# Altium schematic sheet 1_Main.schdoc
size 429 x 307 mm; Symbol: Drawing-Symbol_A3; Device: Drawing-Symbol_A3; @Project Name: f1c200-lom-1g; @Page Count: 1; @Update Date: 2025-12-02; @Create Date: 2025-12-02; @Schematic Name: f1c200-lom_1; @Page No: 1; @Page Name: F1C100; Company: EasyEDA.com; Version: V1.0; Page Size: A3; @Create Time: 20:13:40; @Update Time: 20:01:16; Width: 1655; Height: 1170; Region Start: 1; X Region Count: 6; Y Region Count: 4; Blade Width: 10; Title Block Position: 3; @Board Name: f1c200-dev-board
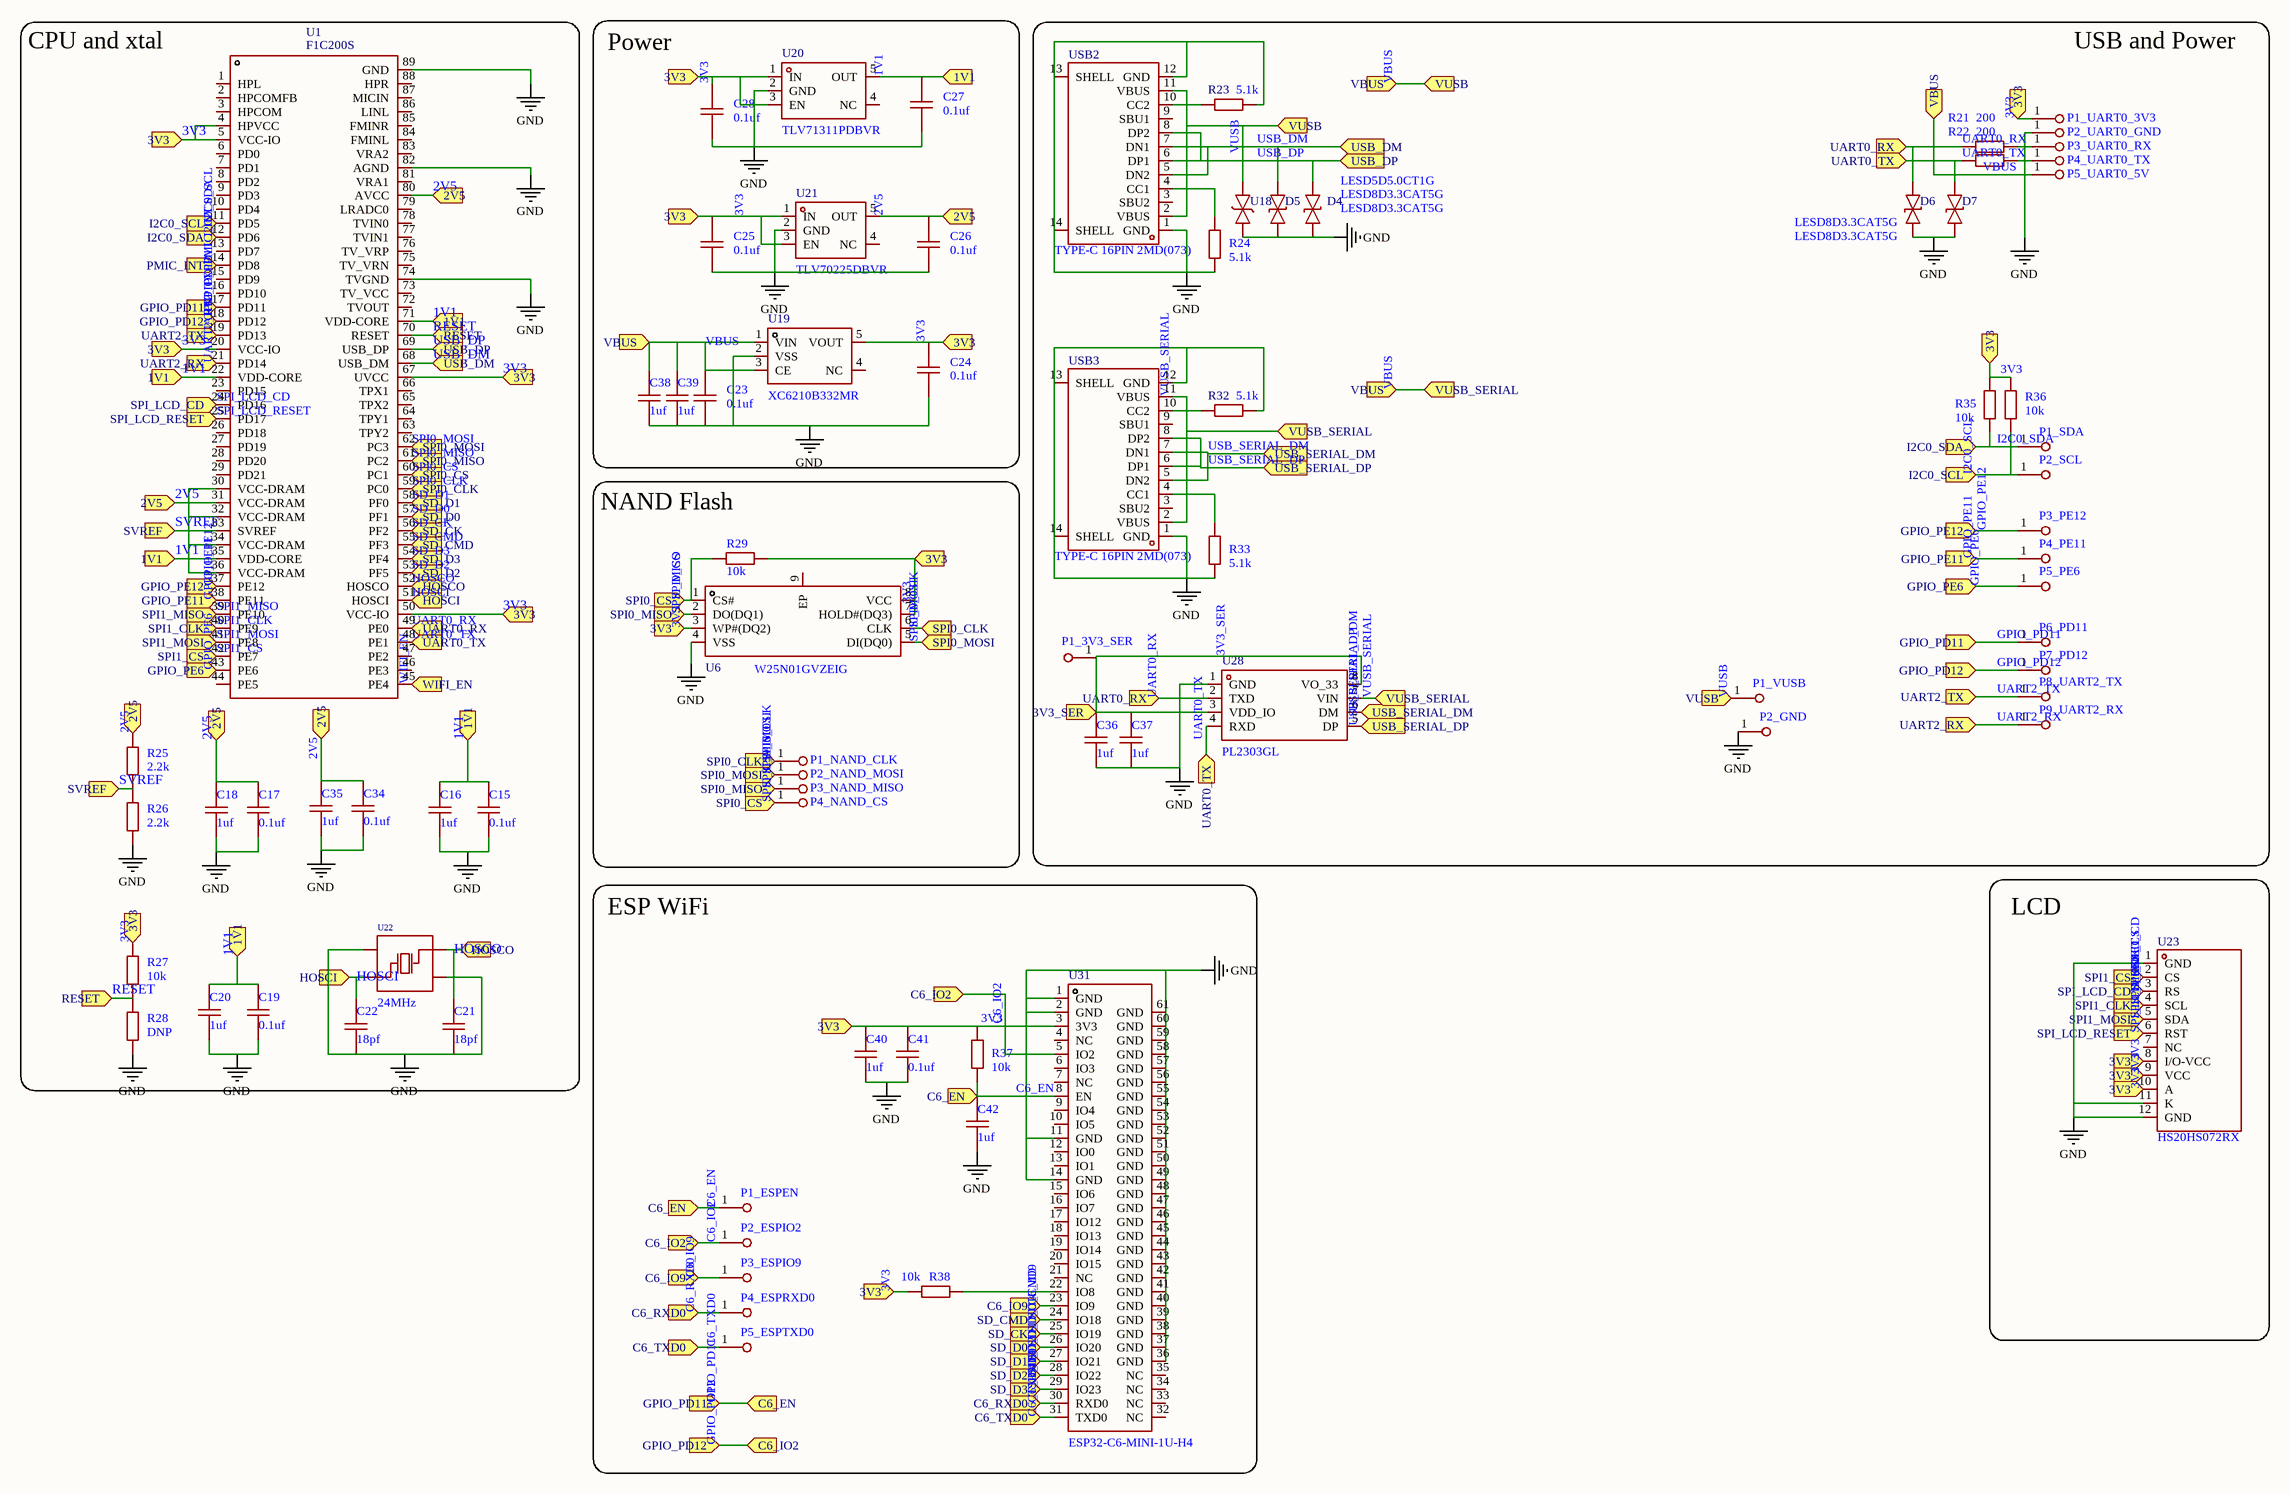
[diagram p0: 1_Main.schdoc]

## Parts
C15  0.1uf  [C0402]
C16  1uf  [C0402]
C17  0.1uf  [C0402]
C18  1uf  [C0402]
C19  0.1uf  [C0402]
C20  1uf  [C0402]
C21  18pf  [C0402]
C22  18pf  [C0402]
C23  0.1uf  [C0402]
C24  0.1uf  [C0402]
C25  0.1uf  [C0402]
C26  0.1uf  [C0402]
C27  0.1uf  [C0402]
C28  0.1uf  [C0402]
C34  0.1uf  [C0402]
C35  1uf  [C0402]
C36  1uf  [C0402]
C37  1uf  [C0402]
C38  1uf  [C0402]
C39  1uf  [C0402]
C40  1uf  [C0402]
C41  0.1uf  [C0402]
C42  1uf  [C0402]
D4  LESD8D3.3CAT5G  [SOD-882_L1.0-W0.6-BI]
D5  LESD8D3.3CAT5G  [SOD-882_L1.0-W0.6-BI]
D6  LESD8D3.3CAT5G  [SOD-882_L1.0-W0.6-BI]
D7  LESD8D3.3CAT5G  [SOD-882_L1.0-W0.6-BI]
P1_3V3_SER  (no value)  [FCPAD_1.5_1.0mm]
P1_ESPEN  (no value)  [FCPAD_1.5_1.0mm]
P1_NAND_CLK  (no value)  [FCPAD_1.5_1.0mm]
P1_SDA  (no value)  [FCPAD_1.5_1.0mm]
P1_UART0_3V3  (no value)  [FCPAD_1.5_1.0mm]
P1_VUSB  (no value)  [FCPAD_1.5_1.0mm]
P2_ESPIO2  (no value)  [FCPAD_1.5_1.0mm]
P2_GND  (no value)  [FCPAD_1.5_1.0mm]
P2_NAND_MOSI  (no value)  [FCPAD_1.5_1.0mm]
P2_SCL  (no value)  [FCPAD_1.5_1.0mm]
P2_UART0_GND  (no value)  [FCPAD_1.5_1.0mm]
P3_ESPIO9  (no value)  [FCPAD_1.5_1.0mm]
P3_NAND_MISO  (no value)  [FCPAD_1.5_1.0mm]
P3_PE12  (no value)  [FCPAD_1.5_1.0mm]
P3_UART0_RX  (no value)  [FCPAD_1.5_1.0mm]
P4_ESPRXD0  (no value)  [FCPAD_1.5_1.0mm]
P4_NAND_CS  (no value)  [FCPAD_1.5_1.0mm]
P4_PE11  (no value)  [FCPAD_1.5_1.0mm]
P4_UART0_TX  (no value)  [FCPAD_1.5_1.0mm]
P5_ESPTXD0  (no value)  [FCPAD_1.5_1.0mm]
P5_PE6  (no value)  [FCPAD_1.5_1.0mm]
P5_UART0_5V  (no value)  [FCPAD_1.5_1.0mm]
P6_PD11  (no value)  [FCPAD_1.5_1.0mm]
P7_PD12  (no value)  [FCPAD_1.5_1.0mm]
P8_UART2_TX  (no value)  [FCPAD_1.5_1.0mm]
P9_UART2_RX  (no value)  [FCPAD_1.5_1.0mm]
R21  200  [R0402]
R22  200  [R0402]
R23  5.1k  [R0402]
R24  5.1k  [R0402]
R25  2.2k  [R0402]
R26  2.2k  [R0402]
R27  10k  [R0402]
R28  DNP  [R0402]
R29  10k  [R0402]
R32  5.1k  [R0402]
R33  5.1k  [R0402]
R35  10k  [R0402]
R36  10k  [R0402]
R37  10k  [R0402]
R38  10k  [R0402]
U1  F1C200S  [QFN-88_L10.0-W10.0-P0.40-BL-EP6.75]
U6  W25N01GVZEIG  [WSON-8_L8.0-W6.10-P1.27-BL-EP]
U18  LESD5D5.0CT1G  [SOD-523_L1.2-W0.8-LS1.6-BI]
U19  XC6210B332MR  [TSOT-23-5_L2.9-W1.6-P0.95-LS2.8-BR]
U20  TLV71311PDBVR  [SOT-23-5_L3.0-W1.7-P0.95-LS2.8-BL]
U21  TLV70225DBVR  [SOT-23-5_L2.9-W1.6-P0.95-LS2.8-BR]
U22  24MHz  [CRYSTAL-SMD_4P-L2.0-W1.6-BL]
U23  HS20HS072RX  [OLED-SMD_HS20HS072RX]
U28  PL2303GL  [SOP-8_L4.9-W3.9-P1.27-LS6.0-BL]
U31  ESP32-C6-MINI-1U-H4  [WIFIM-SMD_61P-L13.2-W12.5-P0.80]
USB2  TYPE-C 16PIN 2MD(073)  [USB-C-SMD_TYPE-C-6PIN-2MD-073]
USB3  TYPE-C 16PIN 2MD(073)  [USB-C-SMD_TYPE-C-6PIN-2MD-073]

## Blocks framed on the sheet
CPU and xtal: C15-C22 C34 C35 R25-R28 U1 U22
Power: C23-C28 C38 C39 U19-U21
USB and Power: C36 C37 D4-D7 P1_3V3_SER P1_SDA P1_UART0_3V3 P1_VUSB P2_GND P2_SCL P2_UART0_GND P3_PE12 P3_UART0_RX P4_PE11 P4_UART0_TX P5_PE6 P5_UART0_5V P6_PD11 P7_PD12 P8_UART2_TX P9_UART2_RX R21-R24 R32 R33 R35 R36 U18 U28 USB2 USB3
NAND Flash: P1_NAND_CLK P2_NAND_MOSI P3_NAND_MISO P4_NAND_CS R29 U6
ESP WiFi: C40-C42 P1_ESPEN P2_ESPIO2 P3_ESPIO9 P4_ESPRXD0 P5_ESPTXD0 R37 R38 U31
LCD: U23

## Ports
1V1 (in), 2V5 (in), 3V3 (in), 3V3_SER (in), C6_EN (in), C6_IO2 (in), C6_IO9 (in), C6_RXD0 (in), C6_TXD0 (in), GPIO_PD11 (in), GPIO_PD12 (in), GPIO_PE6 (in), GPIO_PE11 (in), GPIO_PE12 (in), HOSCI (in), HOSCO (in), I2C0_SCL (in), I2C0_SDA (in), PMIC_INT (in), RESET (in), SD_CK (in), SD_CMD (in), SD_D0 (in), SD_D1 (in), SD_D2 (in), SD_D3 (in), SPI0_CLK (in), SPI0_CS (in), SPI0_MISO (in), SPI0_MOSI (in), SPI1_CLK (in), SPI1_CS (in), SPI1_MISO (in), SPI1_MOSI (in), SPI_LCD_CD (in), SPI_LCD_RESET (in), SVREF (in), UART0_RX (in), UART0_TX (in), UART2_RX (in), UART2_TX (in), USB_DM (in), USB_DP (in), USB_SERIAL_DM (in), USB_SERIAL_DP (in), VBUS (in), VUSB (in), VUSB_SERIAL (in), WIFI_EN (in)

## Nets
GND: C15.2 C16.2 C17.2 C18.2 C19.2 C20.2 C21.2 C22.2 C23.2 C24.2 C25.2 C26.2 C27.2 C28.2 C34.2 C35.2 C36.2 C37.2 C38.2 C39.2 C40.2 C41.2 C42.2 D4.1 D5.1 D6.1 D7.1 P2_GND.1 P2_UART0_GND.1 R23.2 R24.1 R26.1 R28.1 R32.2 R33.1 U1.74(TVGND) U1.82(AGND) U1.89(GND) U6.4(VSS) U18.1 U19.2(VSS) U20.2(GND) U21.2(GND) U22.2(GND) U22.4(GND) U23.1(GND) U23.11(K) U23.12(GND) U28.1(GND) U31.1(GND) U31.2(GND) U31.11(GND) U31.14(GND) U31.36(GND) U31.37(GND) U31.38(GND) U31.39(GND) U31.40(GND) U31.41(GND) U31.42(GND) U31.43(GND) U31.44(GND) U31.45(GND) U31.46(GND) U31.47(GND) U31.48(GND) U31.49(GND) U31.50(GND) U31.51(GND) U31.52(GND) U31.53(GND) U31.54(GND) U31.55(GND) U31.56(GND) U31.57(GND) U31.58(GND) U31.59(GND) U31.60(GND) U31.61(GND) USB2.1(GND) USB2.12(GND) USB2.13(SHELL) USB2.14(SHELL) USB3.1(GND) USB3.12(GND) USB3.13(SHELL) USB3.14(SHELL)
1V1: C15.1 C16.1 C19.1 C20.1 C27.1 U1.22(VDD-CORE) U1.35(VDD-CORE) U1.71(VDD-CORE) U20.5(OUT) ; port 1V1
2V5: C17.1 C18.1 C26.1 C34.1 C35.1 R25.2 U1.30(VCC-DRAM) U1.31(VCC-DRAM) U1.32(VCC-DRAM) U1.34(VCC-DRAM) U1.36(VCC-DRAM) U1.80(AVCC) U21.5(OUT) ; port 2V5
3V3: C24.1 C25.1 C28.1 C40.1 C41.1 P1_UART0_3V3.1 R27.2 R29.1 R35.2 R36.1 R37.2 R38.2 U1.4(HPVCC) U1.5(VCC-IO) U1.20(VCC-IO) U1.50(VCC-IO) U1.67(UVCC) U6.3(WP#(DQ2)) U6.7(HOLD#(DQ3)) U6.8(VCC) U19.5(VOUT) U20.1(IN) U20.3(EN) U21.1(IN) U21.3(EN) U23.8(I/O-VCC) U23.9(VCC) U23.10(A) U31.3(3V3) ; port 3V3
3V3_SER: C36.1 C37.1 P1_3V3_SER.1 U28.3(VDD_IO) U28.8(VO_33) ; port 3V3_SER
C6_EN: C42.1 P1_ESPEN.1 P6_PD11.1 R37.1 U1.17(PD11) U31.8(EN) ; port GPIO_PD11, port C6_EN  [also labelled GPIO_PD11]
C6_IO2: P2_ESPIO2.1 P7_PD12.1 U1.18(PD12) U31.5(IO2) ; port GPIO_PD12, port C6_IO2  [also labelled GPIO_PD12]
C6_IO9: P3_ESPIO9.1 U31.23(IO9) ; port C6_IO9
C6_RXD0: P4_ESPRXD0.1 U31.30(RXD0) ; port C6_RXD0
C6_TXD0: P5_ESPTXD0.1 U31.31(TXD0) ; port C6_TXD0
GPIO_PE6: P5_PE6.1 U1.43(PE6) ; port GPIO_PE6
GPIO_PE11: P4_PE11.1 U1.38(PE11) ; port GPIO_PE11
GPIO_PE12: P3_PE12.1 U1.37(PE12) ; port GPIO_PE12
HOSCI: C22.1 U1.51(HOSCI) U22.1(IN/OUT) ; port HOSCI
HOSCO: C21.1 U1.52(HOSCO) U22.3(OUT/IN) ; port HOSCO
I2C0_SCL: P2_SCL.1 R36.2 U1.11(PD5) ; port I2C0_SCL
I2C0_SDA: P1_SDA.1 R35.1 U1.12(PD6) ; port I2C0_SDA
PMIC_INT: U1.14(PD8) ; port PMIC_INT
RESET: R27.1 R28.2 U1.70(RESET) ; port RESET
SD_CK: U1.56(PF2) U31.25(IO19) ; port SD_CK
SD_CMD: U1.55(PF3) U31.24(IO18) ; port SD_CMD
SD_D0: U1.57(PF1) U31.26(IO20) ; port SD_D0
SD_D1: U1.58(PF0) U31.27(IO21) ; port SD_D1
SD_D2: U1.53(PF5) U31.28(IO22) ; port SD_D2
SD_D3: U1.54(PF4) U31.29(IO23) ; port SD_D3
SPI0_CLK: P1_NAND_CLK.1 U1.59(PC0) U6.6(CLK) ; port SPI0_CLK
SPI0_CS: P4_NAND_CS.1 R29.2 U1.60(PC1) U6.1(CS#) ; port SPI0_CS
SPI0_MISO: P3_NAND_MISO.1 U1.61(PC2) U6.2(DO(DQ1)) ; port SPI0_MISO
SPI0_MOSI: P2_NAND_MOSI.1 U1.62(PC3) U6.5(DI(DQ0)) ; port SPI0_MOSI
SPI1_CLK: U1.40(PE9) U23.4(SCL) ; port SPI1_CLK
SPI1_CS: U1.42(PE7) U23.2(CS) ; port SPI1_CS
SPI1_MISO: U1.39(PE10) ; port SPI1_MISO
SPI1_MOSI: U1.41(PE8) U23.5(SDA) ; port SPI1_MOSI
SPI_LCD_CD: U1.24(PD16) U23.3(RS) ; port SPI_LCD_CD
SPI_LCD_RESET: U1.25(PD17) U23.6(RST) ; port SPI_LCD_RESET
SVREF: R25.1 R26.2 U1.33(SVREF) ; port SVREF
UART0_RX: D6.2 R21.1 U1.49(PE0) U28.2(TXD) ; port UART0_RX
UART0_TX: D7.2 R22.1 U1.48(PE1) U28.4(RXD) ; port UART0_TX
UART2_RX: P9_UART2_RX.1 U1.21(PD14) ; port UART2_RX
UART2_TX: P8_UART2_TX.1 U1.19(PD13) ; port UART2_TX
USB_DM: D5.2 U1.68(USB_DM) USB2.5(DN2) USB2.7(DN1) ; port USB_DM
USB_DP: D4.2 U1.69(USB_DP) USB2.6(DP1) USB2.8(DP2) ; port USB_DP
USB_SERIAL_DM: U28.5(DP) U28.6(DM) USB3.5(DN2) USB3.6(DP1) USB3.7(DN1) USB3.8(DP2) ; port USB_SERIAL_DP, port USB_SERIAL_DM  [also labelled USB_SERIAL_DP]
VBUS: C23.1 C38.1 C39.1 P1_VUSB.1 P5_UART0_5V.1 U18.2 U19.1(VIN) U19.3(CE) U28.7(VIN) USB2.2(VBUS) USB2.11(VBUS) USB3.2(VBUS) USB3.11(VBUS) ; port VBUS, port VUSB, port VUSB_SERIAL  [also labelled VUSB, VUSB_SERIAL]
WIFI_EN: U1.45(PE4) ; port WIFI_EN
NetP3_UART0_RX_1: P3_UART0_RX.1 R21.2
NetP4_UART0_TX_1: P4_UART0_TX.1 R22.2
NetR23_1: R23.1 USB2.10(CC2)
NetR24_2: R24.2 USB2.4(CC1)
NetR32_1: R32.1 USB3.10(CC2)
NetR33_2: R33.2 USB3.4(CC1)
NetR38_1: R38.1 U31.22(IO8)

Not connected (* = marked no-connect by the designer): U1 1(HPL) 2(HPCOMFB) 3(HPCOM) 6(PD0) 7(PD1) 8(PD2) 9(PD3) 10(PD4) 13(PD7) 15(PD9) 16(PD10) 23(PD15) 26(PD18) 27(PD19) 28(PD20) 29(PD21) 44(PE5) 46(PE3) 47(PE2) 63(TPY2) 64(TPY1) 65(TPX2) 66(TPX1) 72(TVOUT) 73(TV_VCC) 75(TV_VRN) 76(TV_VRP) 77(TVIN1) 78(TVIN0) 79(LRADC0) 81(VRA1) 83(VRA2) 84(FMINL) 85(FMINR) 86(LINL) 87(MICIN) 88(HPR); U6 9(EP); U19 4(NC); U20 4(NC); U21 4(NC); U23 7(NC); U31 4(NC) 6(IO3) 7(NC) 9(IO4) 10(IO5) 12(IO0) 13(IO1) 15(IO6) 16(IO7) 17(IO12) 18(IO13) 19(IO14) 20(IO15) 21(NC) 32(NC) 33(NC) 34(NC) 35(NC); USB2 3(SBU2) 9(SBU1); USB3 3(SBU2) 9(SBU1)

## Notes on the sheet
- 1
- 2
- 3
- 4
- 5
- 6
- A
- B
- C
- Schematic
- f1c200-lom_1
- Create at
- Update at
- 2025-12-02
- D
- Board
- Drawn
- f1c200-dev-board
- Page
- F1C100
- Reviewed
- Version
- Size
- f1c200-lom-1g
- Page  1  Total  1
- V1.0
- A3
- EasyEDA.com

## Library data of the parts
C15-C28 C34-C42 = CAP_0402: Symbol: CAP; Convert to PCB: yes; Device: CAP_0402; Add into BOM: yes; Supplier Footprint: 0402
  C15 C17 C19 C23-C28 C34 C41: Value: 0.1uf
  C16 C18 C20 C35-C40 C42: Value: 1uf
  C21 C22: Value: 18pf
D4-D7 = LESD8D3.3CAT5G_C172409: Manufacturer: LRC(乐山无线电); Add into BOM: yes; polarity: Bidirectional; Reverse Stand-Off Voltage (Vrwm): 3.3V; Maximum Clamping Voltage: 10V; Peak Pulse Current (Ipp)@10/1000us: 6A; Breakdown Voltage: 5V; Type: ESD; Symbol: LESD8D3.3CAT5G; Device: LESD8D3.3CAT5G_C172409; LCSC Part Name: 双向ESD; Supplier Part: C172409; Manufacturer Part: LESD8D3.3CAT5G; Supplier Footprint: SOD-882; JLCPCB Part Class: Extended Part; Datasheet: https://atta.szlcsc.com/upload/public/pdf/source/20180130/C172409_15172974211921323438.pdf; Supplier: LCSC; Convert to PCB: yes
P1_3V3_SER P1_ESPEN P1_NAND_CLK P1_SDA P1_UART0_3V3 P1_VUSB P2_ESPIO2 P2_GND P2_NAND_MOSI P2_SCL P2_UART0_GND P3_ESPIO9 P3_NAND_MISO P3_PE12 P3_UART0_RX P4_ESPRXD0 P4_NAND_CS P4_PE11 P4_UART0_TX P5_ESPTXD0 P5_PE6 P5_UART0_5V P6_PD11 P7_PD12 P8_UART2_TX P9_UART2_RX = PAD 1.5x1.5: Add into BOM: no; Convert to PCB: yes; Symbol: PAD 1.5x1.5; Device: PAD 1.5x1.5
R21-R27 R29 R32 R33 R35-R38 = Res_0402: Symbol: Res; Convert to PCB: yes; Device: Res_0402; Add into BOM: yes; Supplier Footprint: 0402
  R21 R22: Value: 200
  R23 R24 R32 R33: Value: 5.1k
  R25 R26: Value: 2.2k
  R27 R29 R35-R38: Value: 10k
R28 = Res_0402: Symbol: Res; Convert to PCB: yes; Add into BOM: no; Device: Res_0402; Supplier Footprint: 0402; Value: DNP
U1 = F1C200S: Manufacturer: Allwinner(全志); Symbol: F1C100S; Add into BOM: yes; Device: F1C200S; LCSC Part Name: Allwinner F1C200S; Supplier Part: C2879851; Manufacturer Part: F1C200S; Supplier Footprint: QFN-88-EP(10x10); JLCPCB Part Class: Extended Part; Datasheet: https://atta.szlcsc.com/upload/public/pdf/source/20211016/C2879851_80200E64F493B5C5B5C583D1EECFE2F1.pdf; Supplier: LCSC; Convert to PCB: yes; CPU Core: -
U6 = W25N01GVZEIG: Manufacturer: Winbond(华邦); Symbol: W25N01GVZEIG_C907680; Add into BOM: yes; Memory Size: 1Gbit; Interface: SPI; Clock Frequency: 104MHz; Voltage - Supply: 2.7V~3.6V; Page Program time (TPP): 250us; Block Erase Time(tBE): 2ms; Data Retention - TDR (Year): 10 Years; Device: W25N01GVZEIG; LCSC Part Name: 具备双/四路SPI缓冲读取和连续读取功能的3V、1Gb串行SLCNAND闪存; Supplier Part: C907680; Manufacturer Part: W25N01GVZEIG; Supplier Footprint: WSON-8-EP(6.1x8); JLCPCB Part Class: Extended Part; Datasheet: https://item.szlcsc.com/datasheet/W25N01GVZEIG/973560.html; Supplier: LCSC; Convert to PCB: yes; Write Cycle Time(tWC): -; Operating Temperature: -40℃~+85℃
U18 = LESD5D5.0CT1G_C7433850: Manufacturer: KUU; Add into BOM: yes; polarity: Bidirectional; Reverse Stand-Off Voltage (Vrwm): 5V; Maximum Clamping Voltage: 15V; Peak Pulse Current (Ipp): 5A; Peak Pulse Power Dissipation (Ppp): 75W; Breakdown Voltage: 9V; Reverse Leakage Current (Ir): 1uA; Number of Lines: Single channel; Symbol: LESD5D5.0CT1G_C7433850; Device: LESD5D5.0CT1G_C7433850; LCSC Part Name: LESD5D5.0CT1G; Supplier Part: C7433850; Manufacturer Part: LESD5D5.0CT1G; Supplier Footprint: SOD-523; JLCPCB Part Class: Extended Part; Datasheet: https://atta.szlcsc.com/upload/public/pdf/source/20230627/C0A560C15CDA16113FFF50176A12D929.pdf; Supplier: LCSC; Convert to PCB: yes; Type: ESD
U19 = XC6210B332MR: Manufacturer: TOREX(特瑞仕); Symbol: XC6210B332MR_C424705; Add into BOM: yes; Output Type: Fixed; Voltage - Supply: 6V; Output Voltage: 3.3V; Output Current: 900mA; Power Supply Rejection Ratio (PSRR): 60dB@(1kHz); Voltage Dropout: 75mV@(100mA); standby current: 35uA; Output Configuration: Positive; Number of Outputs: 1; Device: XC6210B332MR; LCSC Part Name: 输入6V 输出3.3V 900mA; Supplier Part: C424705; Manufacturer Part: XC6210B332MR; Supplier Footprint: SOT-25; JLCPCB Part Class: Extended Part; Datasheet: https://item.szlcsc.com/datasheet/XC6210B332MR/418424.html; Supplier: LCSC; Convert to PCB: yes; Features: Over Current Protection；Over Temperature Protection; Operating Temperature: -40℃~+85℃@(Ta)
U20 = TLV71311PDBVR: Manufacturer: TI(德州仪器); Add into BOM: yes; Output Type: Fixed; Voltage - Supply: 5.5V; Output Voltage: 1.1V; Output Current: 150mA; Power Supply Rejection Ratio (PSRR): 65dB@(1kHz); Voltage Dropout: 470mV@(100mA); standby current: 50uA; Noise: 55uVrms; Output Configuration: Positive; Number of Outputs: 1; Symbol: TLV71311PDBVR; Device: TLV71311PDBVR; LCSC Part Name: 具有主动输出放电和使能功能的 150mA、低压降无电容稳压器; Supplier Part: C205964; Manufacturer Part: TLV71311PDBVR; Supplier Footprint: SOT-23-5; JLCPCB Part Class: Extended Part; Datasheet: https://www.ti.com/cn/lit/gpn/tlv713p; Supplier: LCSC; Convert to PCB: yes; Features: Over Current Protection；Thermal Shutdown; Operating Temperature: -40℃~+125℃@(Tj)
U21 = TLV70225DBVR: Manufacturer: TI(德州仪器); Add into BOM: yes; Output Type: Fixed; Maximum Input Voltage: 5.5V; Output Voltage: 2.5V; Output Current: 300mA; Power Supply Rejection Ratio (PSRR): 68dB@(1kHz); Dropout Voltage: 380mV@(300mA); standby current: 55uA; Output Polarity: Positive electrode; Number of Outputs: 1; Symbol: TLV70225DBVR; Device: TLV70225DBVR; LCSC Part Name: 具有使能功能的 300mA、高 PSRR、低 IQ、低压降稳压器; Supplier Part: C2877849; Manufacturer Part: TLV70225DBVR; Supplier Footprint: SOT-23-5; JLCPCB Part Class: Extended Part; Datasheet: https://www.ti.com/cn/lit/gpn/tlv702; Supplier: LCSC; Convert to PCB: yes; Feature: 防静电保护；自动放电功能；低ESR；Thermal Protection(TSD)；欠压闭锁；Overcurrent Protection(OCP)；带使能; Operating Temperature: -40℃~+125℃@(Tj)
U22 = ECS-240-12-37B-CKY-TR: Manufacturer: ECS; Add into BOM: yes; Normal temperature Frequency Tolerance: ±10ppm; Load Capacitance: 12pF; Equivalent Series Resistance(ESR): 50Ω; Symbol: ECS-240-12-37B-CKY-TR; Device: ECS-240-12-37B-CKY-TR; Supplier: LCSC; Supplier Part: C2450025; Manufacturer Part: ECS-240-12-37B-CKY-TR; Value: 24MHz; JLCPCB Part Class: Extended Part; LCSC Part Name: 24MHz ±10ppm 12pF; Supplier Footprint: SMD2016-4P; Datasheet: https://item.szlcsc.com/datasheet/ECS-240-12-37B-CKY-TR/2541879.html; Convert to PCB: yes; Frequency Stability: ±10ppm; Operating Temperature: -30℃~+85℃
U23 = HS20HS072RX: Manufacturer: HS(汉昇); Add into BOM: yes; Controller Type: ST7789; Dot Pixels: 320x240; Symbol: HS20HS072RX; Device: HS20HS072RX; LCSC Part Name: 2.0寸240*320(RGB)彩色SPI串口TFT液晶显示屏; Supplier Part: C5329582; Manufacturer Part: HS20HS072RX; Supplier Footprint: -; JLCPCB Part Class: Extended Part; Datasheet: https://atta.szlcsc.com/upload/public/pdf/source/20221215/8081666AF7BFDE257CAA474692F2FEBB.pdf; Supplier: LCSC; Convert to PCB: yes; Size: 2; Operating Temperature: -20℃~+70℃
U28 = PL2303GL: Manufacturer: PROLIFIC(旺玖); Add into BOM: yes; Symbol: PL2303GL; Device: PL2303GL; LCSC Part Name: 8引脚USB转UART桥接控制器IC; Supplier Part: C2905408; Manufacturer Part: PL2303GL; Supplier Footprint: SOP-8; JLCPCB Part Class: Extended Part; Datasheet: https://item.szlcsc.com/datasheet/PL2303GL/3175113.html; Supplier: LCSC; Convert to PCB: yes
U31 = ESP32-C6-MINI-1U-H4: Manufacturer: ESPRESSIF(乐鑫); Add into BOM: yes; Symbol: ESP32-C6-MINI-1U-H4; Device: ESP32-C6-MINI-1U-H4; LCSC Part Name: ESP32-C6-MINI-1U-H4; Supplier Part: C20627095; Manufacturer Part: ESP32-C6-MINI-1U-H4; Supplier Footprint: SMD,13.2x12.5mm; JLCPCB Part Class: Extended Part; Datasheet: https://item.szlcsc.com/datasheet/ESP32-C6-MINI-1U-H4/22039339.html; Supplier: LCSC; Convert to PCB: yes
USB2 USB3 = TYPE-C 16PIN 2MD(073): Manufacturer: SHOU HAN(首韩); Add into BOM: yes; Gender: Female; Number of Contacts: 16P; Number of Ports: 1; Current Rating - Power (Max): 5A; Rated Voltage (Max): 5V; Connect-Disconnect Life: 5000 Cuts; Core Colour: Black; Symbol: TYPE-C 16PIN 2MD(073); Device: TYPE-C 16PIN 2MD(073); LCSC Part Name: Type-C 母 卧贴; Supplier Part: C2765186; Manufacturer Part: TYPE-C 16PIN 2MD(073); Supplier Footprint: SMD; JLCPCB Part Class: Extended Part; Datasheet: https://atta.szlcsc.com/upload/public/pdf/source/20211123/39B17C16241EAC15C5E277BDA434118E.pdf; Supplier: LCSC; Convert to PCB: yes; Connector Type: Type-C; Standard: USB 3.1; Mounting Style: Horizontal attachment; Operating Temperature Range: -25℃~+85℃